# EAGLE design ESP12E BMS Low Voltage (EAGLE 9.6.2)
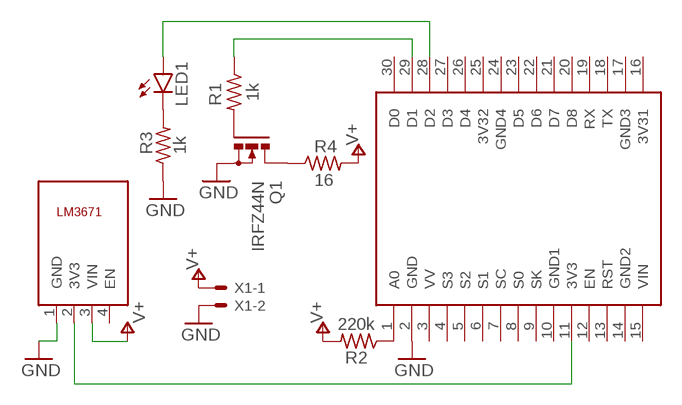
[diagram p0: schematic, sheet 1]

## Parts
LED1  TLLR4400  [LED3MM]
Q1  IRFZ44N  PMOSFET_NTO220BH  [TO220BH]
R1  1k  R-US_0204/7  [0204/7]
R2  220k  R-US_0204/7  [0204/7]
R3  1k  R-US_0204/7  [0204/7]
R4  16  R-US_0613/15  [P0613/15]
U$1  NODEMCU  [NODEMCU]
U$2  LM3671  [LM3671]
X1  JST-XH-02-PIN-ROUND-PAD  [JST-XH-02-PACKAGE-ROUND-PAD]

## Nets
GND: Q1.S R3.1 U$1.2(GND) U$2.1(GND) X1.2
N$1: LED1.K(C) R3.2
N$2: Q1.G R1.2
N$3: Q1.D R4.1
N$4: R1.1 U$1.29(D1)
N$5: LED1.A U$1.28(D2)
N$6: R2.1 U$1.1(A0)
N$7: U$1.11(3V3) U$2.2(3V3)
V+: R2.2 R4.2 U$2.3(VIN) X1.1
Unconnected: U$1.3(VV) U$1.4(S3) U$1.5(S2) U$1.6(S1) U$1.7(SC) U$1.8(S0) U$1.9(SK) U$1.12(EN) U$1.13(RST) U$1.15(VIN) U$1.18(TX) U$1.19(RX) U$1.20(D8) U$1.21(D7) U$1.22(D6) U$1.23(D5) U$1.26(D4) U$1.27(D3) U$1.30(D0) U$2.4(EN)

## Power pins joined to a net without a drawn wire
3V31: U$1.16(3V31)
3V32: U$1.25(3V32)
GND1: U$1.10(GND1)
GND2: U$1.14(GND2)
GND3: U$1.17(GND3)
GND4: U$1.24(GND4)

## Library data of the parts
LED1 = led:TLLR4400: Low Current (2mA) LED 3 mm Tinted Diffused Package color RED Source: Data sheet <http://www.farnell.com/datasheets/391100.pdf>; MF: VISHAY SEMICONDUCTOR; OC_FARNELL: 1612437
Q1 = transistor-power:PMOSFET_N: Power MOSFET N-Channel
R1-R4 = rcl:R-US_: RESISTOR, American symbol; SPICEPREFIX: R
U$1 = nodemcuFix:NODEMCU
U$2 = LM3671:LM3671: Adafruit LM3671 3.3V Buck Converter Breakout 3.3V Output 600mA Max Product ID: 2745
X1 = Rembrandt Electronics - JST XH Connectors v1-0:JST-XH-02-PIN: JST XH Connector 2 Pin Wire to board connector. Pitch: 2,54 mm, (0.100") Number of pins: 2 Created by Rembrandt Electronics www.rembrandtelectronics.com

## Board
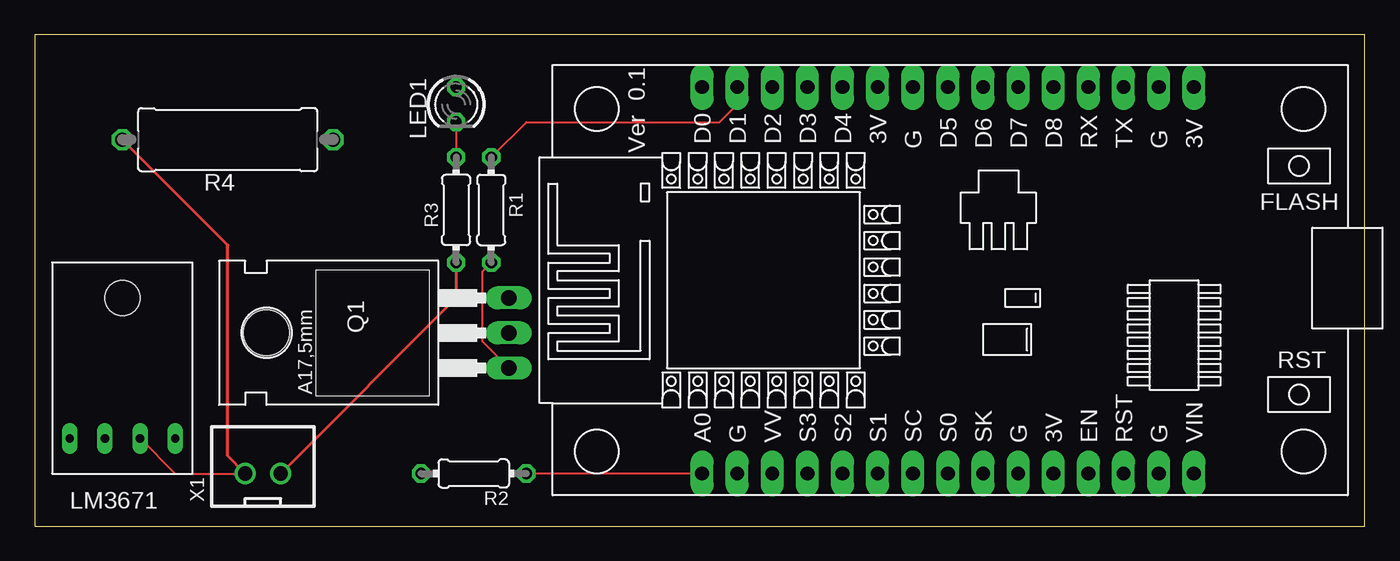
[diagram p1: board, top side]
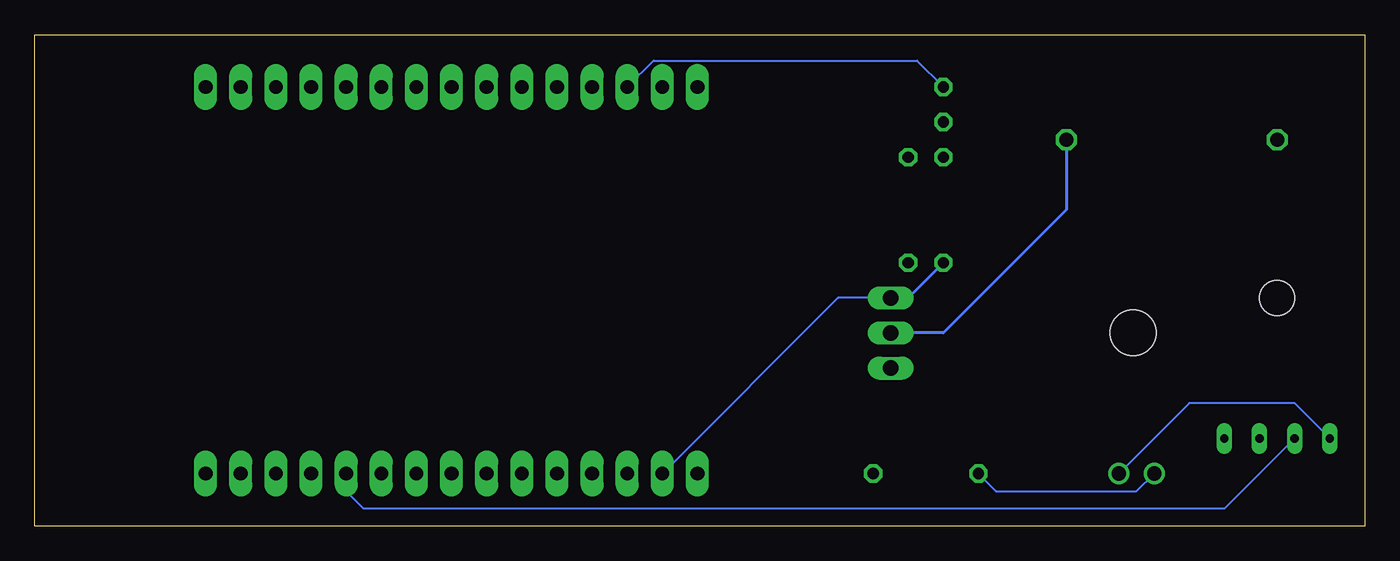
[diagram p2: board, bottom side, seen from below]

Size 96.19 x 35.53 mm. Coordinates in mm from the lower left corner, seen from the top.
Outline: 0,0 96.19,0 96.19,35.54 0,35.54 0,0
Copper layers (1*16): Top 0.035mm / dielectric 1.5mm / Bottom 0.035mm
Design rules "default": minimum track width 6mil, minimum drill 0.35mm, track to track 6mil, track to pad 6mil, pad to pad 6mil, via to via 6mil, smd to smd 6mil, copper to edge 40mil, drill to drill 6mil, minimum pad ring 10mil, minimum via ring 8mil, stop-mask expansion 4mil, vias tented up to drill 0mil, thermal gap 10mil

### Footprints (pad centres in the part's own frame; a part is rotated, then mirrored left to right if it is on the bottom)
LED3MM = drill 0.813 octagon: A -1.27,0; K 1.27,0
TO220BH = drill 1.118 long: D 0,-6.35; G -2.54,-6.35; S 2.54,-6.35 | hole 3.302: 0,11.176
0204/7 = drill 0.813 octagon: 1 -3.81,0; 2 3.81,0
P0613/15 = drill 1.016 octagon: 1 -7.62,0; 2 7.62,0
NODEMCU = drill 1 pad 1.676 long: 1 -13.97,17.78; 2 -13.97,15.24; 3 -13.97,12.7; 4 -13.97,10.16; 5 -13.97,7.62; 6 -13.97,5.08; 7 -13.97,2.54; 8 -13.97,0; 9 -13.97,-2.54; 10 -13.97,-5.08; 11 -13.97,-7.62; 12 -13.97,-10.16; 13 -13.97,-12.7; 14 -13.97,-15.24; 15 -13.97,-17.78; 16 13.97,-17.78; 17 13.97,-15.24; 18 13.97,-12.7; 19 13.97,-10.16; 20 13.97,-7.62; 21 13.97,-5.08; 22 13.97,-2.54; 23 13.97,0; 24 13.97,2.54; 25 13.97,5.08; 26 13.97,7.62; 27 13.97,10.16; 28 13.97,12.7; 29 13.97,15.24; 30 13.97,17.78
LM3671 = drill 0.6 long: 1 -3.81,-5.08; 2 -1.27,-5.08; 3 1.27,-5.08; 4 3.81,-5.08 | hole 2.54: 0,5.08
JST-XH-02-PACKAGE-ROUND-PAD = drill 1.016: 1 -1.27,0; 2 1.27,0

### Placement (x,y rotation side)
LED1  30.48,30.48 270 top
Q1  27.94,13.97 90 top
R1  33.02,22.86 270 top
R2  31.75,3.81 180 top
R3  30.48,22.86 90 top
R4  13.97,27.94 180 top
U$1  66.04,17.78 90 top
U$2  6.35,11.43 0 top
X1  16.51,3.81 0 top

### Tracks (layer width: path | path; a pad name or v marks a point on that pad's centre or on a via)
GND
  Top 0.203: X1.2 30.48,16.51 R3.1
  Bottom 0.152: X1.2 12.7,8.89 5.08,8.89 U$2.1 | Q1.S 38.1,16.51 U$1.2
  Bottom 0.203: R3.1 33.02,16.51 Q1.S
N$1
  Top 0.152: LED1.K R3.2
N$2
  Top 0.152: R1.2 32.38,18.41 32.38,13.34 Q1.G
N$3
  Bottom 0.203: R4.1 21.59,22.86 30.48,13.97 Q1.D
N$4
  Top 0.152: R1.1 35.56,29.21 49.53,29.21 50.8,30.48 U$1.29
N$5
  Bottom 0.152: LED1.A 32.38,33.66 51.43,33.66 U$1.28
N$6
  Top 0.152: U$1.1 R2.1
N$7
  Bottom 0.152: U$2.2 10.16,1.27 72.39,1.27 73.66,2.54 U$1.11
V+
  Top 0.152: X1.1 10.16,3.81 U$2.3
  Top 0.203: R4.2 13.97,20.32 13.97,5.08 X1.1
  Bottom 0.152: X1.1 16.51,2.54 26.67,2.54 R2.2